# EAGLE design v5_DEF (EAGLE 6.4)
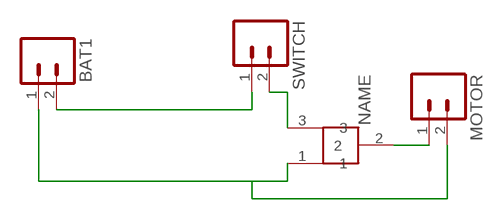
[diagram p0: schematic, sheet 1]

## Parts
BAT1  M02-JST-2-PTH-NO_SILK  [JST-2-PTH-NS]
MOTOR  M02-JST-2-PTH-NO_SILK  [JST-2-PTH-NS]
SWITCH  M02-JST-2-PTH-NO_SILK  [JST-2-PTH-NS]
U$1  BOURNS3313JBOURNS3313J  [BOURNS3313J]

## Nets
GND: BAT1.1 MOTOR.2 U$1.1
N$1: BAT1.2 SWITCH.1
N$2: SWITCH.2 U$1.3
N$4: MOTOR.1 U$1.2

## Library data of the parts
BAT1 MOTOR SWITCH = SparkFun-Connectors:M02: Header 2 Standard 2-pin 0.1" header. Use with straight break away headers (SKU : PRT-00116), right angle break away headers (PRT-00553), swiss pins (PRT-00743), machine pins (PRT-00117), and female headers (PRT-00115). Molex polarized connector foot print use with SKU : PRT-08233 with associated crimp pins and housings.
U$1 = andrea:BOURNS3313J

## Board
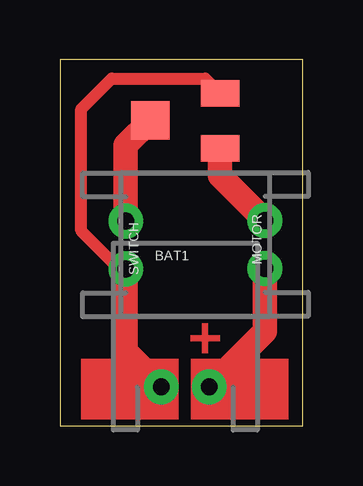
[diagram p1: board, top side]

Size 10.13 x 15.25 mm. Coordinates in mm from the lower left corner, seen from the top.
Outline: 0,0 10.13,0 10.13,15.25 0,15.25 0,0
Copper layers (1*16): Top 0.035mm / dielectric 1.5mm / Bottom 0.035mm
Design rules "default": minimum track width 10mil, minimum drill 24mil, track to track 8mil, track to pad 8mil, pad to pad 8mil, via to via 8mil, smd to smd 8mil, copper to edge 40mil, drill to drill 8mil, minimum pad ring 10mil, minimum via ring 8mil, stop-mask expansion 4mil, vias tented up to drill 0mil, thermal gap 10mil

### Footprints (pad centres in the part's own frame; a part is rotated, then mirrored left to right if it is on the bottom)
JST-2-PTH-NS = drill 0.7 pad 1.448: 1 -1,0; 2 1,0
BOURNS3313J = smd 1.1 x 1.6: 1 1.152,-0.799; 3 -1.147,-0.804 | smd 1.6 x 1.6: 2 0.016,2.112

### Placement (x,y rotation side)
BAT1  5.23,1.62 0 top
MOTOR  2.75,7.54 270 top
SWITCH  8.55,7.56 90 top
U$1  5.88,12.71 90 top

### Tracks (layer width: path | path; a pad name or v marks a point on that pad's centre or on a via)
GND
  Top 0.508: MOTOR.2 2.48,6.54 0.89,8.13 0.89,13.21 2.16,14.48 6.07,14.48 U$1.1
  Top 1.016: MOTOR.2 2.75,3.1 BAT1.1
N$1
  Top 1.016: SWITCH.1 8.55,3.94 BAT1.2
N$2
  Top 1.016: U$1.3 6.69,10.43 SWITCH.2
N$4
  Top 1.016: MOTOR.1 2.75,11.71 U$1.2
(copper drawn outside any net)
  shapes: Top area x2

### Text on the board
Top: +